# Altium schematic sheet RGB to PAL Encoder.SchDoc: RGB to PAL Encoder
size A4; Organization: Altium Limited; Address1: L3, 12a Rodborough Rd; Address2: Frenchs Forest; Address3: NSW; Address4: Australia 2086; Revision: 1; SheetNumber: 8; SheetTotal: 11; Alumno: Diego Caceres; Curso: R1051; Materia: Sistemas de Representación; Docentes: Ing. Perdomo, Ing. Fuoco, Ing. Giorno, Sr. Vergili
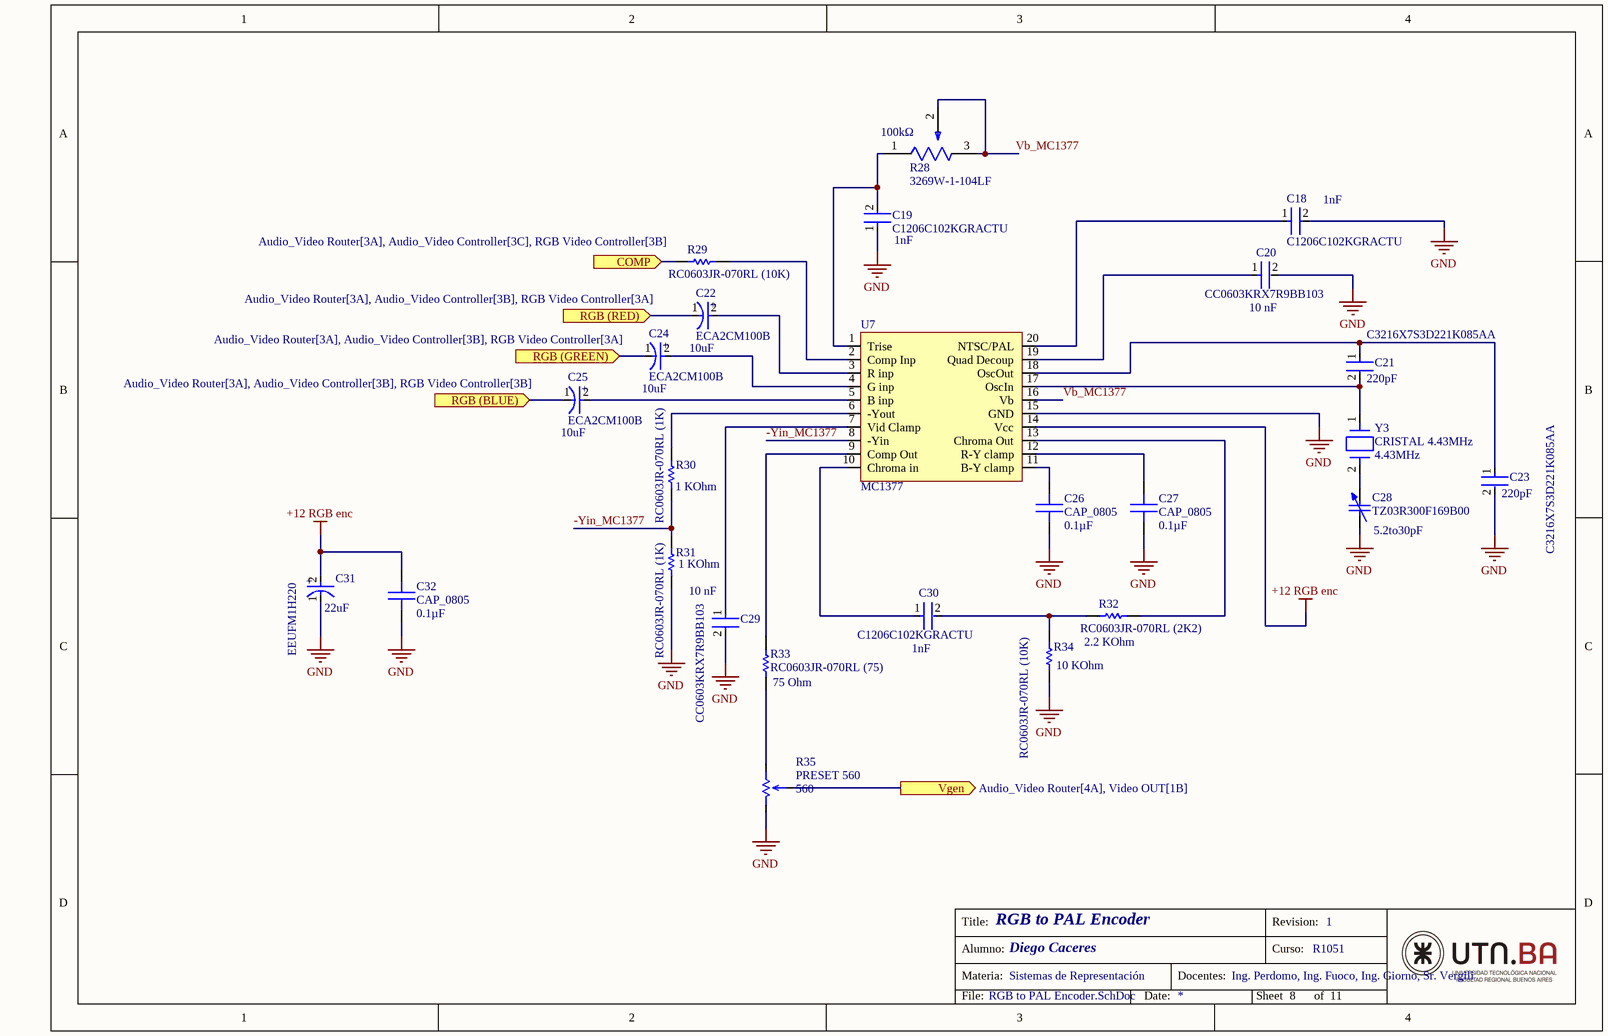
[diagram p0: RGB to PAL Encoder.SchDoc]

## Parts
C18  C1206C102KGRACTU  Capacitance: 1nF  [FP-C1206C-EF-MFG]
C19  C1206C102KGRACTU  Capacitance: 1nF  [FP-C1206C-EF-MFG]
C20  CC0603KRX7R9BB103  Capacitance: 10 nF  [FP-CC0603-DA-MFG]
C21  C3216X7S3D221K085AA  Capacitance: 220pF  [FP-C3216-085-0_2-MFG]
C22  ECA2CM100B  Capacitance: 10uF  [FP-RAD-TH-D_10_0_5-L_12_5-MFG]
C23  C3216X7S3D221K085AA  Capacitance: 220pF  [FP-C3216-085-0_2-MFG]
C24  ECA2CM100B  Capacitance: 10uF  [FP-RAD-TH-D_10_0_5-L_12_5-MFG]
C25  ECA2CM100B  Capacitance: 10uF  [FP-RAD-TH-D_10_0_5-L_12_5-MFG]
C26  CAP_0805  value 0.1µF  [0805_CAPACITOR_DCACERES]
C27  CAP_0805  value 0.1µF  [0805_CAPACITOR_DCACERES]
C28  TZ03R300F169B00  Capacitance: 5.2to30pF  [MURA-TZ03-2_V]
C29  CC0603KRX7R9BB103  value 10 nF  [FP-CC0603-DA-MFG]
C30  C1206C102KGRACTU  Capacitance: 1nF  [FP-C1206C-EF-MFG]
C31  EEUFM1H220  Capacitance: 22uF  [FP-RAD-TH-D_5_0_5-L_11_1-MFG]
C32  CAP_0805  value 0.1µF  [0805_CAPACITOR_DCACERES]
R28  3269W-1-104LF  Resistance: 100kΩ  [FP-3269W-MFG]
R29  RC0603JR-070RL (10K)  [RESC1608X55X25ML10T15]
R30  RC0603JR-070RL (1K)  Resistance: 1 KOhm  [RESC1608X55X25ML10T15]
R31  RC0603JR-070RL (1K)  Resistance: 1 KOhm  [RESC1608X55X25ML10T15]
R32  RC0603JR-070RL (2K2)  Resistance: 2.2 KOhm  [RESC1608X55X25ML10T15]
R33  RC0603JR-070RL (75)  Resistance: 75 Ohm  [RESC1608X55X25ML10T15]
R34  RC0603JR-070RL (10K)  Resistance: 10 KOhm  [RESC1608X55X25ML10T15]
R35  PRESET 560  value 560  [3386P_PRESET_560_DCaceres]
U7  MC1377  [CASE 738-03_ISSUE E_MC1377_DCACERES]
Y3  CRISTAL 4.43MHz  Frequency: 4.43MHz  [HC-49/US_SMD_CRISTAL 4.43MHz_DCACERES]

## Ports
COMP (in, see Audio_Video Router[3A], Audio_Video Controller[3C], RGB Video Controller[3B]), RGB (BLUE) (in, see Audio_Video Router[3A], Audio_Video Controller[3B], RGB Video Controller[3B]), RGB (GREEN) (in, see Audio_Video Router[3A], Audio_Video Controller[3B], RGB Video Controller[3A]), RGB (RED) (in, see Audio_Video Router[3A], Audio_Video Controller[3B], RGB Video Controller[3A]), Vgen (out, see Audio_Video Router[4A], Video OUT[1B])

## Nets
+12 RGB enc: C31.2(A) C32.2 U7.14(Vcc)
GND: C18.2 C19.1 C20.2 C23.2 C26.1 C27.1 C28.1 C29.2 C31.1(C) C32.1 R31.2 R34.2 R35.1 U7.15(GND)
-Yin_MC1377: R30.2 R31.1 U7.8(-Yin)
COMP: R29.2 ; port COMP
RGB (BLUE): C25.1(C) ; port RGB (BLUE)
RGB (GREEN): C24.1(C) ; port RGB (GREEN)
RGB (RED): C22.1(C) ; port RGB (RED)
Vb_MC1377: R28.2(WIPER) R28.3(CW) U7.16(Vb)
Vgen: R35.3 ; port Vgen
NetC18_1: C18.1 U7.20(NTSC/PAL)
NetC19_2: C19.2 R28.1(CCW) U7.1(Trise)
NetC20_1: C20.1 U7.19(Quad_Decoup)
NetC21_1: C21.1 C23.1 U7.18(OscOut)
NetC21_2: C21.2 U7.17(OscIn) Y3.1
NetC22_2: C22.2(A) U7.3(R_inp)
NetC24_2: C24.2(A) U7.4(G_inp)
NetC25_2: C25.2(A) U7.5(B_inp)
NetC26_2: C26.2 U7.11(B-Y_clamp)
NetC27_2: C27.2 U7.12(R-Y_clamp)
NetC28_2: C28.2 Y3.2
NetC29_1: C29.1 U7.7(Vid_Clamp)
NetC30_1: C30.1 U7.10(Chroma_in)
NetC30_2: C30.2 R32.2 R34.1
NetR29_1: R29.1 U7.2(Comp_Inp)
NetR30_1: R30.1 U7.6(-Yout)
NetR32_1: R32.1 U7.13(Chroma_Out)
NetR33_1: R33.1 R35.2
NetR33_2: R33.2 U7.9(Comp_Out)

## Notes on the sheet
- Title:
- Revision:
- Alumno:
- Materia:
- Docentes:
- Curso:
- File:
- Date:
- Sheet
- of
- (in symbol CMP-05427-000661-1) +
- (in symbol CMP-05427-001124-1) +

## Library data of the parts
C18 C19 C30 = CMP-03020-034681-1: CAP CER 1000PF 2KV X7R 1206; Tolerance: 10%; Dissipation Factor: 2.5%; Dielectric Material: Ceramic; Voltage Rating (DC): 2.5kV; Voltage: 2kV; REACH SVHC: No SVHC; Height: 1.6mm; Construction: Flat; Case/Package: 1206; Series: C; Mount: Surface Mount; RoHS Compliant: Yes; Package Quantity: 1; Length: 3.2mm; Width: 0.063inch; Voltage Rating: 2kV; Min Operating Temperature: -55°C; Case Code (Metric): 3216; Termination: SMD/SMT; Number of Pins: 2; Case Code (Imperial): 1206; Packaging: Tape and Reel; Dielectric: X7R; Thickness: 0.069inch; Depth: 1.6mm; Radiation Hardening: No; Max Operating Temperature: 125°C
C20 = CMP-2100-03600-2: CAP CER 10000PF 50V X7R 0603; Manufacturer: YAGEO; Tolerance: 0.1; Material: Ceramic; Temperature Coefficient: 15%; Value: 10 nF; Mouser Description: Multilayer Ceramic Capacitor, CC Series, 0.01 - F, - 10%, X7R, 50 V, 0603 [1608 Metric]; Digikey Description: CAP CER 10000PF 50V X7R 0603; Height: 0.9mm; Category: Cap; Temperature Characteristic: X7R; Footprint Url: http://www.yageo.com/exep/pages/download/literatures/UPY-C_GEN_24.pdf; Lead Free: Yes; Voltage Rating: 50 V; Manufacturer Part Number: CC0603KRX7R9BB103; Temperature: -55°C to +125°C; Device Class L3: Ceramic Capacitors; ComponentLink2Description: Datasheet; Voltage: 50 V; Package: CC0603-DA; Octopart: https://octopart.com/cc0603krx7r9bb103-yageo-192938; Automotive: No; Temperature Range High: +125°C; Temperature Range Low: -55°C; RoHS: TRUE; Device Class L1: Passive Components; ComponentLink2URL: http://www.yageo.com/documents/recent/UPY-GPHC_X7R_6.3V-to-50V_18.pdf; Device Class L2: Capacitors
C21 C23 = CMP-08246-003329-1: Multilayer Ceramic Capacitors 220pF ±10% 2000V X7S SMD 1206; Voltage Rating (DC): 2kV; Max Operating Temperature: 125°C; Termination: SMD/SMT; Dielectric: X7S; Case/Package: 1206; Mount: Surface Mount; Tolerance: 10%; Package Quantity: 1; Weight: 0.000571oz; Width: 0.063inch; RoHS Compliant: Yes; Thickness: 0.039inch; Series: C; Packaging: Tape and Reel; Min Operating Temperature: -55°C; Resistor Type: Ceramic; Case Code (Imperial): 1206; Voltage Rating: 2kV; Case Code (Metric): 3216; Depth: 1.6mm; Length: 0.126inch; REACH SVHC: No SVHC
C22 C24 C25 = CMP-05427-001124-1: Aluminum Electrolytic Capacitors (Radial Lead Type) 10uF ±20% 160V; Ripple Current: 105mA; Life (Hours): 2000Hour; Lead/Base Style: Straight; Weight: 0.01lb; Max Operating Temperature: 85°C; Termination: Radial; Min Operating Temperature: -25°C; Series: M; Tolerance: 20%; Voltage Rating (DC): 160V; RoHS Compliant: Yes; Case/Package: Radial; Radiation Hardening: No; Mount: Through Hole; Width: 4inch; Height: 12.5mm; Diameter: 10mm; Packaging: Ammo Pack; Lead Pitch: 5mm; Voltage Rating: 160V; Package Quantity: 500; Length: 12.5mm; Height - Seated (Max): 0.531inch
C26 C27 C32 = CAPACITOR_0805_Caceres: Capacitor SMD, encapsulado 0805; SizePackage: 0805; ComponentLink1Description: Datasheet1; ComponentLink1URL: https://www.mouser.com/datasheet/2/40/AutoMLCCKAM-3216307.pdf; ComponentLink2Description: Datasheet2; ComponentLink2URL: https://www.mouser.com/datasheet/2/447/KEM_C1086_U2J-3316409.pdf; ComponentLink3Description: Datasheet3; ComponentLink3URL: https://product.tdk.com/system/files/dam/doc/product/capacitor/ceramic/mlcc/catalog/mlcc_commercial_soft_en.pdf
C28 = CMP-2000-07339-1: Variable Capacitor, Miniature Ceramic Trimmer, Green, 30 pF, -25 to 85 degC, 2-Pin THD, Bulk; Manufacturer: Murata; Dielectric: N750; Tolerance (%): 0to50%; Rated Voltage: 100V; Datasheet URL: https://datasheet.ciiva.com/29339/12-0130e-29339940.pdf; Mounting Technology: ThroughHole; Manufacturer URL: http://www.murata.com/; Package Reference: TZ03; Case Size/Dimension: 6x6x4.8mm; Datasheet Version: Rev. A, 04/2003; Package Description: 2-Pin Through Hole Device, Dia 6 mm, Body Length 4.8 mm
C29 = CMP-2100-03600-2: CAP CER 10000PF 50V X7R 0603; Manufacturer: YAGEO; Tolerance: 0.1; Material: Ceramic; Temperature Coefficient: 15%; Mouser Description: Multilayer Ceramic Capacitor, CC Series, 0.01 - F, - 10%, X7R, 50 V, 0603 [1608 Metric]; Digikey Description: CAP CER 10000PF 50V X7R 0603; Height: 0.9mm; Category: Cap; Temperature Characteristic: X7R; Footprint Url: http://www.yageo.com/exep/pages/download/literatures/UPY-C_GEN_24.pdf; Lead Free: Yes; Voltage Rating: 50 V; Manufacturer Part Number: CC0603KRX7R9BB103; Temperature: -55°C to +125°C; Device Class L3: Ceramic Capacitors; ComponentLink2Description: Datasheet; Voltage: 50 V; Package: CC0603-DA; Octopart: https://octopart.com/cc0603krx7r9bb103-yageo-192938; Automotive: No; Temperature Range High: +125°C; Temperature Range Low: -55°C; RoHS: TRUE; Device Class L1: Passive Components; ComponentLink2URL: http://www.yageo.com/documents/recent/UPY-GPHC_X7R_6.3V-to-50V_18.pdf; Device Class L2: Capacitors; Capacitance: 10 nF
C31 = CMP-05427-000661-1: Aluminum Electrolytic Capacitors (Radial Lead Type) 22uF ±20% 50V; Impedance: 340mR; Life (Hours): 2000Hour; Dissipation Factor: 0.1%; Ripple Current: 250mA; Lead Diameter: 0.5mm; REACH SVHC: No SVHC; Tolerance: 20%; Max Operating Temperature: 105°C; RoHS Compliant: Yes; Height - Seated (Max): 0.492inch; Number of Pins: 2; Case/Package: Radial; Series: FM; ESR (Equivalent Series Resistance): 340mR; Length: 11mm; Radiation Hardening: No; Voltage: 50V; Min Operating Temperature: -40°C; Voltage Rating: 50V; Voltage Rating (DC): 50V; Lead Free: Lead Free; Package Quantity: 200; Lead Pitch: 2mm; Height: 11mm; Mount: Through Hole; Construction: RADIAL; Termination: Radial; Diameter: 5mm; Packaging: Bulk
R28 = CMP-07234-000021-1: TRIMMER 100K OHM 0.25W SMD; Manufacturer: Bourns; Temperature Coefficient: 100ppm/°C; Tolerance: 10%; Value: 100kΩ; Composition: Cermet; Height: 8.96mm; ComponentLink2URL: https://www.bourns.com/docs/Product-Datasheets/3269.pdf; Mouser Description: Res Cermet Trimmer 100K Ohm 10% 1/4W 12(Elec)Turn 1.78mm (6.35 X 6.36 X 8.46mm) Gull Wing SMD Tube; ComponentLink2Description: Datasheet; Temperature Range High: +150°C; Temperature: -65°C to +150°C; Series: 3269; Device Class L1: Passive Components; RoHS: TRUE; Octopart: https://octopart.com/3269w-1-104lf-bourns-114162; Temperature Range Low: -65°C; Device Class L2: Resistors; Digikey Description: TRIMMER 100K OHM 0.25W SMD; Manufacturer Part Number: 3269W-1-104LF; Power Rating: 0.25W; Device Class L3: Variable Resistors and Potentiometers; Lead Free: Yes; Package: 3269W; Category: Res; Automotive: No
R29 = CMP-2100-03667-1: Chip Resistor, 0 Ohm, +/- 5%, 0.1 W, -55 to 155 degC, 0603 (1608 Metric), RoHS, Tape and Reel; Manufacturer: Yageo; Temperature Coefficient: 200ppm/degreesC; Voltage Rating: 50V; Power Rating: 100mW; Resistance: 0mOhm; Width: 0.8mm; Max Operating Temperature: 155degC; Tolerance: 5%; Package Reference: 0603; Height: 0.45mm; Depth: 0.8mm; Package Description: 2-Pin Surface Mount Device, Body 1.6 x 0.8 mm; Termination: SMD/SMT; Package Quantity: 5000; Case/Package: 0603; Case Code (Imperial): 0603; Radiation Hardening: No; Number of Pins: 2; Length: 1.6mm; Lead Free: LeadFree; Voltage Rating (DC): 50V; Military Standard: Not; Datasheet URL: http://www.yageo.com/NewPortal/yageodocoutput?fileName=/pdf/R-Chip/PYu-RC_Group_51_RoHS_L_5.pdf; Manufacturer URL: http://www.yageo.com/; Packaging: TapeandReel; Case Code (Metric): 1608; Min Operating Temperature: -55degC; Composition: ThickFilm; RoHSCompliant: true; Contact Plating: Tin; Datasheet Version: Rev. 5, 10/2016; REACH SVHC: NoSVHC
R30-R34 = CMP-2100-03667-1: Chip Resistor, 0 Ohm, +/- 5%, 0.1 W, -55 to 155 degC, 0603 (1608 Metric), RoHS, Tape and Reel; Manufacturer: Yageo; Temperature Coefficient: 200ppm/degreesC; Voltage Rating: 50V; Power Rating: 100mW; Width: 0.8mm; Max Operating Temperature: 155degC; Tolerance: 5%; Package Reference: 0603; Height: 0.45mm; Depth: 0.8mm; Package Description: 2-Pin Surface Mount Device, Body 1.6 x 0.8 mm; Termination: SMD/SMT; Package Quantity: 5000; Case/Package: 0603; Case Code (Imperial): 0603; Radiation Hardening: No; Number of Pins: 2; Length: 1.6mm; Lead Free: LeadFree; Voltage Rating (DC): 50V; Military Standard: Not; Datasheet URL: http://www.yageo.com/NewPortal/yageodocoutput?fileName=/pdf/R-Chip/PYu-RC_Group_51_RoHS_L_5.pdf; Manufacturer URL: http://www.yageo.com/; Packaging: TapeandReel; Case Code (Metric): 1608; Min Operating Temperature: -55degC; Composition: ThickFilm; RoHSCompliant: true; Contact Plating: Tin; Datasheet Version: Rev. 5, 10/2016; REACH SVHC: NoSVHC
R35 = Preset_560_Caceres: Preset 560, Thru Hole / Manufacturer Part Search 3386P-1-472LF; PartNumber: 3386P-1-472LF; ComponentLink1Description: Package Specification; ComponentLink1URL: https://ar.mouser.com/datasheet/2/54/3386-776606.pdf; ComponentLink2Description: URL Link; ComponentLink2URL: https://www.mouser.com/ProductDetail/Bourns/3386P-1-472LF?qs=g1MxsQ5vwlSvqan31esVSg%3D%3D
U7 = MC1377_Caceres: MC1377, Thru Hole; PartNumber: MC1377P; Manufacturer: Motorola; ComponentLink1Description: Datasheet; ComponentLink1URL: https://datasheet.ciiva.com/pdfs/VipMasterIC/IC/MOTO/MOTOS06243/MOTOS06243-1.pdf?src-supplier=IHS+Markit; PackageReference: DIP20 CASE 738; Terminal Form: Through Hole
Y3 = Cristal_4.43MHz_Caceres: Cristal SMD 4.43MHz; PartNumber: ABLS-4.433619MHZ-B4-T; Manufacturer: Abracon; ComponentLink1Description: Datasheet; ComponentLink1URL: https://www.mouser.com/datasheet/2/3/abls-1664338.pdf; ComponentLink2Description: URL Link1; ComponentLink2URL: https://www.mouser.com/ProductDetail/ABRACON/ABLS-4.433619MHZ-B4-T?qs=yTU0IcKoRlG9N56A3ODkIg%3D%3D; ComponentLink3Description: URL Link2; ComponentLink3URL: https://www.digikey.com/en/products/detail/abracon-llc/ABLS-4-433619MHZ-B4-T/2184147?s=N4IgTCBcDaIIICEAyBlAtAFgHQYMy4DYBGATgFkAJALTQQzQBUQBdAXyA; Package: HC-49/US; TerminalForm: SMD; Series: ABLS